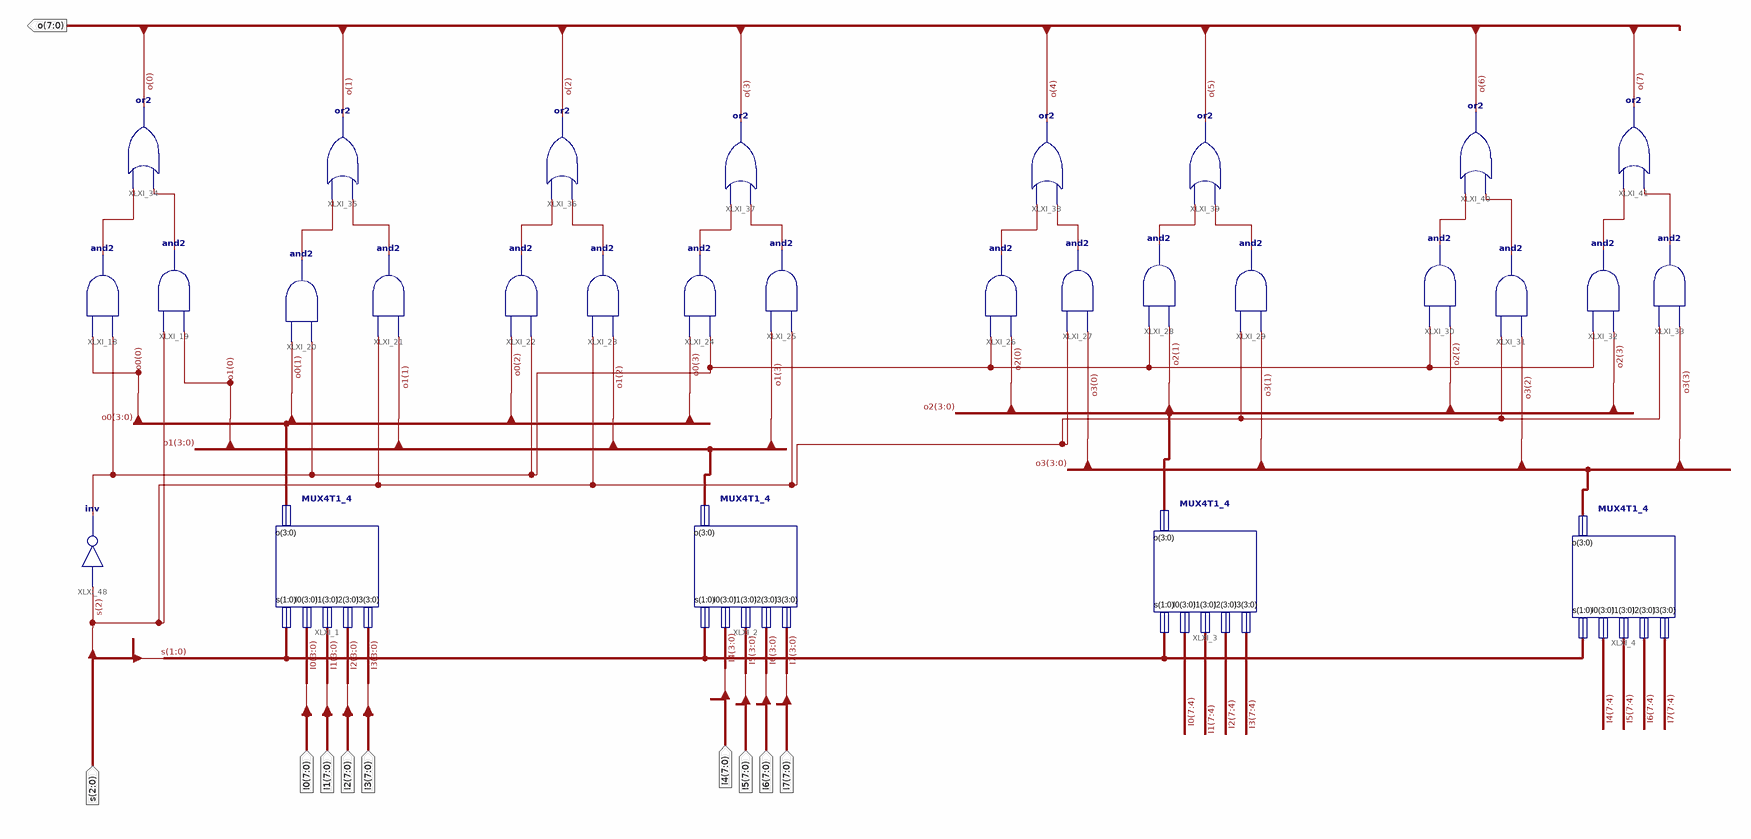
[diagram p0: schematic sheet 1]
// Xilinx ISE schematic MUX8T1_8_sch.sch (kintex7) as structural Verilog: 29 symbols, 10 ports
module MUX8T1_8_sch (
  input  [2:0] s,
  input  [7:0] I0,
  input  [7:0] I1,
  input  [7:0] I2,
  input  [7:0] I3,
  input  [7:0] I5,
  input  [7:0] I6,
  input  [7:0] I7,
  input  [7:0] I4,
  output [7:0] o
);

  wire XLXN_62, XLXN_68, XLXN_70, XLXN_71, XLXN_72, XLXN_73, XLXN_74, XLXN_75, XLXN_76, XLXN_77, XLXN_79,
       XLXN_80, XLXN_81, XLXN_82, XLXN_83, XLXN_84, XLXN_85;
  wire [3:0] o0, o1, o2, o3;

  MUX4T1_4 XLXI_1 (.s(s[1:0]), .I0(I0[3:0]), .I1(I1[3:0]), .I2(I2[3:0]), .I3(I3[3:0]), .o(o0));
  MUX4T1_4 XLXI_2 (.s(s[1:0]), .I0(I4[3:0]), .I1(I5[3:0]), .I2(I6[3:0]), .I3(I7[3:0]), .o(o1));
  MUX4T1_4 XLXI_3 (.s(s[1:0]), .I0(I0[7:4]), .I1(I1[7:4]), .I2(I2[7:4]), .I3(I3[7:4]), .o(o2));
  MUX4T1_4 XLXI_4 (.s(s[1:0]), .I0(I4[7:4]), .I1(I5[7:4]), .I2(I6[7:4]), .I3(I7[7:4]), .o(o3));
  and XLXI_20 (XLXN_71, XLXN_62, o0[1]);
  and XLXI_21 (XLXN_72, o1[1], s[2]);
  and XLXI_22 (XLXN_73, XLXN_62, o0[2]);
  and XLXI_23 (XLXN_74, o1[2], s[2]);
  and XLXI_24 (XLXN_75, XLXN_62, o0[3]);
  and XLXI_25 (XLXN_76, s[2], o1[3]);
  and XLXI_26 (XLXN_85, o2[0], XLXN_62);
  and XLXI_27 (XLXN_84, o3[0], s[2]);
  and XLXI_28 (XLXN_83, o2[1], XLXN_62);
  and XLXI_29 (XLXN_82, o3[1], s[2]);
  or XLXI_34 (o[0], XLXN_70, XLXN_68);
  or XLXI_35 (o[1], XLXN_72, XLXN_71);
  or XLXI_36 (o[2], XLXN_74, XLXN_73);
  or XLXI_37 (o[3], XLXN_76, XLXN_75);
  or XLXI_38 (o[4], XLXN_84, XLXN_85);
  or XLXI_39 (o[5], XLXN_82, XLXN_83);
  or XLXI_40 (o[6], XLXN_80, XLXN_81);
  or XLXI_41 (o[7], XLXN_79, XLXN_77);
  and XLXI_30 (XLXN_81, o2[2], XLXN_62);
  and XLXI_31 (XLXN_80, o3[2], s[2]);
  and XLXI_32 (XLXN_77, o2[3], XLXN_62);
  and XLXI_33 (XLXN_79, o3[3], s[2]);
  and XLXI_18 (XLXN_68, XLXN_62, o0[0]);
  and XLXI_19 (XLXN_70, o1[0], s[2]);
  not XLXI_48 (XLXN_62, s[2]);
endmodule
